# EAGLE design IR_Transceiver (EAGLE 7.2.0)
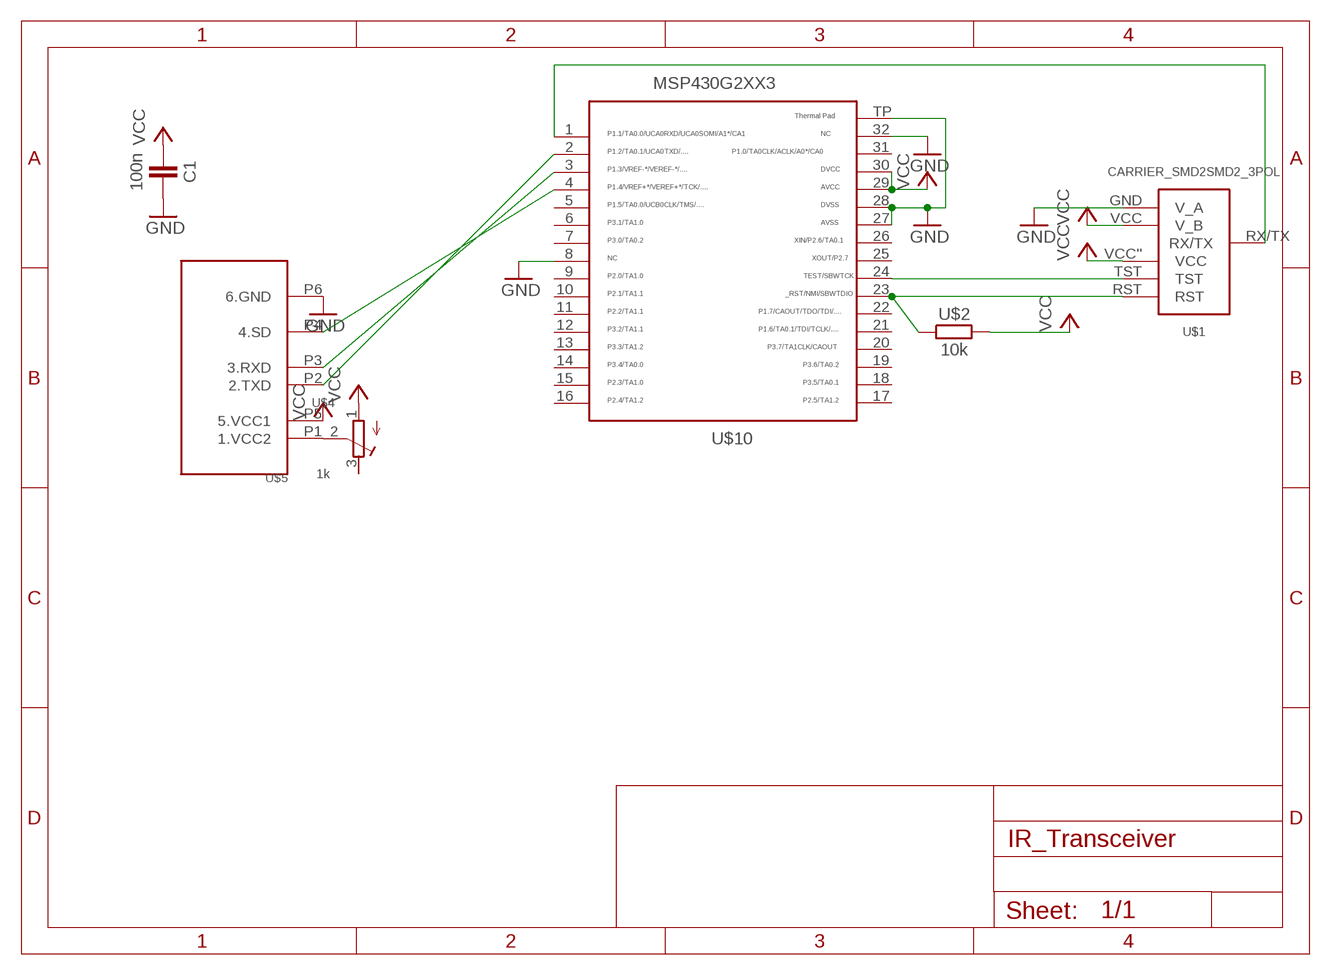
[diagram p0: schematic, sheet 1]

## Parts
C1  100n  CAPACITOR  [603]
U$1  CARRIER_SMD2SMD2_3POL  [CARRIER_SMD2_3POL]
U$2  10k  RESISTOR0603  [603]
U$4  1k  POTISMD  [POTI35]
U$5  TFBS4711  [TFBS4711]
U$10  MSP430G2553  [QFN32]

## Nets
GND: C1.2 U$1.GND(V_A) U$5.P6(6.GND) U$10.8 U$10.27 U$10.28 U$10.32 U$10.TP
N$2: U$4.2(S) U$5.P1(1.VCC2)
N$3: U$1.TST U$10.24
N$4: U$1.RST U$2.1 U$10.23
N$5: U$5.P2(2.TXD) U$10.2
N$6: U$5.P3(3.RXD) U$10.3
N$7: U$5.P4(4.SD) U$10.4
N$12: U$1.RX/TX U$10.1
VCC: C1.1 U$1.VCC''(VCC) U$1.VCC(V_B) U$2.2 U$4.1(A) U$5.P5(5.VCC1) U$10.29 U$10.30
Unconnected: U$4.3(E) U$10.5 U$10.6 U$10.7 U$10.9 U$10.10 U$10.11 U$10.12 U$10.13 U$10.14 U$10.15 U$10.16 U$10.17 U$10.18 U$10.19 U$10.20 U$10.21 U$10.22 U$10.25 U$10.26 U$10.31

## Library data of the parts
C1 = thar:CAPACITOR
U$1 = thar:CARRIER_SMD2
U$2 = thar:RESISTOR
U$4 = thar:POTI: veränderbarer Widerstand
U$5 = aditya_main:TFBS4711
U$10 = thar:MSP430G2553: TEXAS INSTRUMENTS MSP430G2553IRHB32R MCU, 16BIT, MSP430, 16MHZ, QFN-32 Farnell Best.Nr.: 2325726 Herst.Bez.: MSP430G2553IRHB32R

## Board
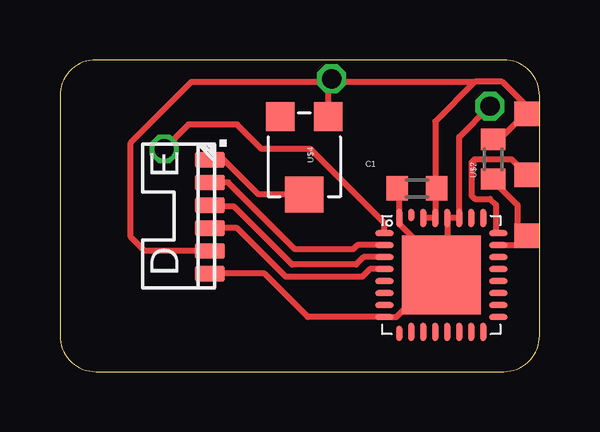
[diagram p1: board, top side]
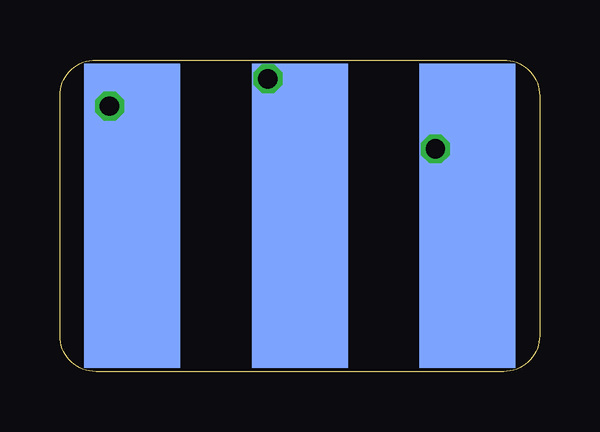
[diagram p2: board, bottom side, seen from below]

Size 20 x 13 mm. Coordinates in mm from the lower left corner, seen from the top.
Copper layers (1*16): Top 0.035mm / dielectric 1.5mm / Bottom 0.035mm
Design rules "Bilex DRU *": minimum track width 10mil, minimum drill 24mil, track to track 10mil, track to pad 10mil, pad to pad 10mil, via to via 10mil, smd to smd 10mil, copper to edge 1mil, drill to drill 8mil, minimum pad ring 10mil, minimum via ring 8mil, stop-mask expansion 4mil, vias tented up to drill 0mil, thermal gap 10mil

### Footprints (pad centres in the part's own frame; a part is rotated, then mirrored left to right if it is on the bottom)
603 = smd 0.889 x 1.016: 1 -0.826,0; 2 0.826,0
CARRIER_SMD2_3POL = smd 4 x 12.7 bottom: GND -6.985,0; RX/TX 6.985,0; VCC 0,0 | smd 1.016 x 1.016: RST -9.461,0.826; TST -9.461,-1.714; VCC'' -9.461,-4.255
POTI35 = smd 1.2 x 1.2: 1 -1.6,1; 3 -1.6,-1 | smd 1.5 x 1.6: 2 1.65,0
TFBS4711 = smd 0.64 x 1.27: P1 4.75,0; P2 3.8,0; P3 2.85,0; P4 1.9,0; P5 0.95,0; P6 0,0
QFN32 = smd 0.762 x 0.254: 1 -2.375,1.75; 2 -2.375,1.25; 3 -2.375,0.75; 4 -2.375,0.25; 5 -2.375,-0.25; 6 -2.375,-0.75; 7 -2.375,-1.25; 8 -2.375,-1.75; 17 2.375,-1.75; 18 2.375,-1.25; 19 2.375,-0.75; 20 2.375,-0.25; 21 2.375,0.25; 22 2.375,0.75; 23 2.375,1.25; 24 2.375,1.75 | smd 0.254 x 0.635: 9 -1.75,-2.438 | smd 0.254 x 0.762: 10 -1.25,-2.375; 11 -0.75,-2.375; 12 -0.25,-2.375; 13 0.25,-2.375; 14 0.75,-2.375; 15 1.25,-2.375; 16 1.75,-2.375; 25 1.75,2.375; 26 1.25,2.375; 27 0.75,2.375; 28 0.25,2.375; 29 -0.25,2.375; 30 -0.75,2.375; 32 -1.75,2.375 | smd 0.254 x 0.508: 31 -1.25,2.5 | smd 3.302 x 3.302: TP 0,0

### Placement (x,y rotation side)
C1  14.89,7.64 180 top
U$1  10,6.5 180 top
U$2  18.06,8.86 90 top
U$4  10.19,9.04 270 top
U$5  6.25,4.08 90 top
U$10  15.9,4.03 0 top

### Tracks (layer width: path | path; a pad name or v marks a point on that pad's centre or on a via)
GND  (via drill 0.8)
  Top 0.254: 16.43,4.35 16.19,5.38 16.16,5.35 | 16.43,4.35 16.48,3.06 U$10.TP 15.01,2.94 14.89,3.14 14.03,2.28 U$10.8 10.34,2.28 8.54,4.08 U$5.P6 | 16.15,4.72 U$10.28 U$10.27 16.65,9.79 v17.93,11.07 | 16.15,4.72 16.15,4.42 16.43,4.35 | 16.15,4.72 15.52,5.35 14.76,5.55 14.15,6.16 U$10.32 14.15,7.49 14.25,7.59 14.12,7.58 C1.2 14.12,7.7
  Bottom 0.254: 18,6.5 17.93,6.57 v17.93,11.07 16.98,10.12 U$1.GND
N$2
  Top 0.254: U$5.P1 6.33,8.91 6.76,8.91 8.28,7.39 U$4.2
N$3
  Top 0.254: 19.61,7.88 19.46,8.02 19.5,8.18 | U$10.24 18.19,5.78 18.19,6.95 17.93,7.21 17.3,7.21 17.17,7.33 17.17,8.73 17.3,8.86 18.82,8.86 19.5,8.18 | 19.5,8.18 U$1.TST
N$4
  Top 0.254: 19.46,5.48 19.5,5.38 | 19.46,5.48 19.48,5.6 | 19.48,5.6 19.5,5.69 19.08,5.74 19.08,6.95 18.06,7.97 U$2.1 | U$10.23 19.28,5.28 19.46,5.48 | U$1.RST 19.46,5.62 19.48,5.6
N$5
  Top 0.254: U$10.2 12.4,5.28 12.22,5.1 9.81,5.1 7.01,7.89 6.26,7.89 U$5.P2
N$6
  Top 0.254: U$10.3 12.66,4.78 12.35,4.46 9.68,4.46 7.27,6.88 6.31,6.88 U$5.P3
N$7
  Top 0.254: U$10.4 12.92,4.28 12.6,3.96 9.43,3.96 7.39,5.99 U$5.P4
N$12  (via drill 0.8)
  Top 0.254: U$10.1 13.53,6.21 10.44,9.29 8.41,9.29 7.39,10.31 5.36,10.31 v4.35,9.29
  Bottom 0.254: 4.03,9.68 v4.35,9.29 3.01,7.96 U$1.RX/TX
VCC  (via drill 0.8)
  Top 0.254: U$10.29 | 15.65,8.02 15.65,10.43 17.3,12.09 | 15.65,8.02 U$10.29 | 15.78,7.77 15.71,8.02 | 15.71,8.02 15.65,8.02 | U$10.29 U$10.30 | C1.1 15.71,8.02 | 19.5,10.52 19.46,10.56 | U$2.2 18.12,9.48 19.2,10.56 19.2,10.51 19.46,10.56 | 19.52,10.62 19.65,10.75 19.52,11.01 18.44,12.09 17.3,12.09 | 19.52,10.62 19.46,10.56 | U$5.P5 3.52,5.03 2.95,5.61 2.95,9.54 5.49,12.09 11.33,12.09 | 11.33,12.09 17.3,12.09 | 11.2,10.43 11.19,10.45 U$4.1 11.19,12.07 v11.33,12.21 11.33,12.09 | U$1.VCC'' 19.46,10.69 19.52,10.62
  Bottom 0.254: 10.06,10.18 v11.33,12.21 10.23,9.85 | 10,9.36 10.23,9.85 | U$1.VCC 10,9.62 10.23,9.85